# Altium schematic sheet Gesture_Sensor.SchDoc: GESTURE SENSOR
size 431 x 279 mm; Date: 02/07/2022; ApprovedBy: RTZ,HYW; CheckedBy: RTZ,HYW; Author: RTZ,HYW; CompanyName: Upenn; DrawnBy: RTZ,HYW; Engineer: RTZ,HYW; Organization: Upenn ESE; Address1: Electrical Engineering; Address2: 200 South 33rd St; Address3: Philadelphia; Address4: PA, 19104; SheetNumber: 10; SheetTotal: 11; ENG_APP_DATE: 02/15/22; DSN_APP_DATE: 02/15/22; CHK_APP_DATE: 02/15/22; DOC_NO_ASSY_DWG: TBD; DOC_NO_FAB_DWG: TBD; PCB_DWG_NO: TBD; Project: SimonSayGame; DESIGN_ITEM: 1.0; DOC_NO_SCH_DWG: TBD; SCH_SCALE: NA; CAGE_CODE: TBD; Time: 13:18
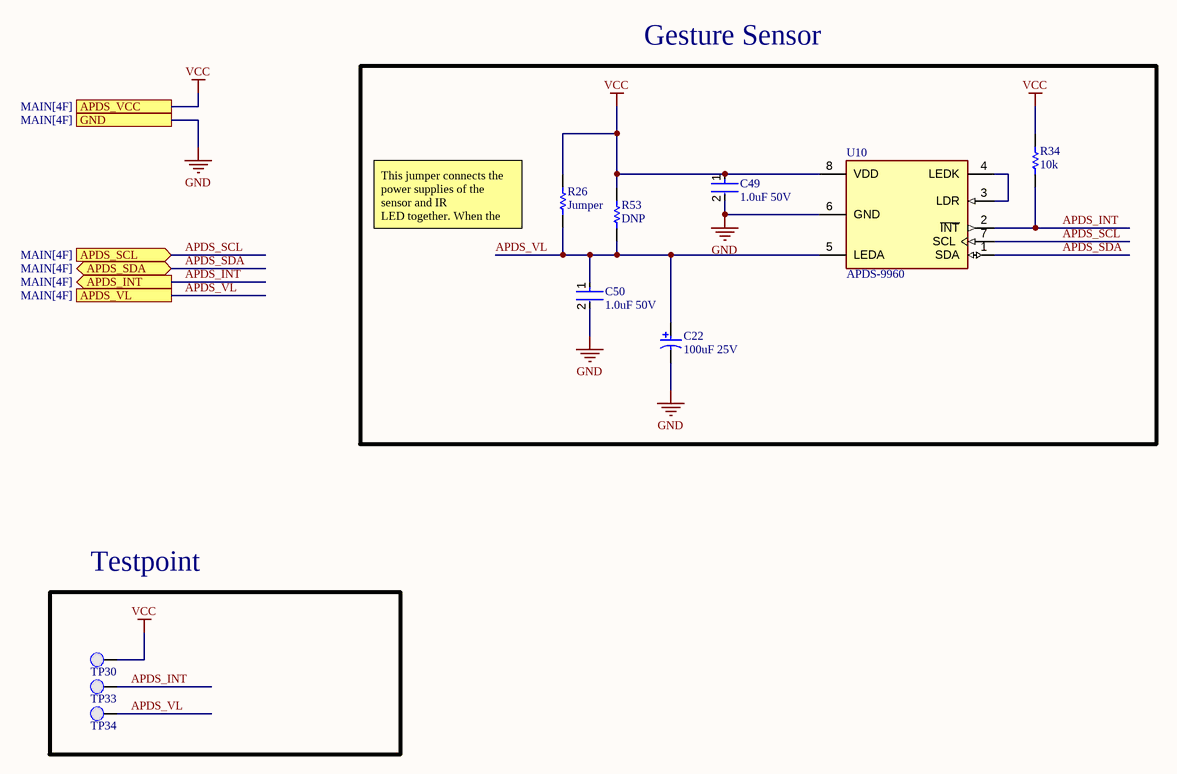
[diagram p0: Gesture_Sensor.SchDoc]

## Parts
C22  100uF 25V  [EDK107M025A9HAA]
C49  1.0uF 50V  [FP-0603-L_1_6_0_1-W_0_8_0-IPC_A]
C50  1.0uF 50V  [FP-0603-L_1_6_0_1-W_0_8_0-IPC_A]
R26  Jumper  [RESC0603(1608)_N]
R34  10k  [RESC1005X40X25ML05T05]
R53  DNP  [DNP]  (no BOM)
TP30  0.1" Pad  [PCBComponent]  (value not drawn)  (no BOM)
TP33  0.1" Pad  [PCBComponent]  (value not drawn)  (no BOM)
TP34  0.1" Pad  [PCBComponent]  (value not drawn)  (no BOM)
U10  APDS-9960  [FP-APDS-9960-MFG]

## Blocks framed on the sheet
Gesture Sensor: C22 C49 C50 R26 R34 R53 U10
Testpoint: TP30 TP33 TP34

## Ports
APDS_INT (out, see MAIN[4F]), APDS_SCL (in, see MAIN[4F]), APDS_SDA (bidir, see MAIN[4F]), APDS_VCC (see MAIN[4F]), APDS_VL (see MAIN[4F]), GND (see MAIN[4F])

## Nets
GND: C22.2 C49.2 C50.2 U10.6(GND) ; port GND
VCC: C49.1 R26.2 R34.2 R53.2 TP30.1(PAD) U10.8(VDD) ; port APDS_VCC
APDS_INT: R34.1 TP33.1(PAD) U10.2(~{INT}) ; port APDS_INT
APDS_SCL: U10.7(SCL) ; port APDS_SCL
APDS_SDA: U10.1(SDA) ; port APDS_SDA
APDS_VL: C22.1 C50.1 R26.1 R53.1 TP34.1(PAD) U10.5(LEDA) ; port APDS_VL
NetU10_3: U10.3(LDR) U10.4(LEDK)

## Notes on the sheet
- (near R26) This jumper connects the power supplies of the sensor and IR
  LED together. When the jumper is
  closed, VCC
  pin will power both the sensor and the IR LED. If the jumper is open,
  you need to provide power to both the VCC (2.4 - 3.6V) and VL (3.0 -
  4.5V) pins separately. This jumper is closed by default.
- DWG. NO.
- REV.
- SHT.
- THIS DOCUMENT AND THE DATA DISCLOSED HEREIN OR HEREWITH IS THE PROPERTY OF ALTIUM LIMITED AND MAY BE FREELY DISTRIBUTED IN WHOLE. NO RIGHTS ARE RESERVED OR EXPRESS OR IMPLIED WARANTEE GIVEN.
- REVISION
- DESCRIPTION
- DATE
- APPROVED
- ENG:
- APPROVALS
- PROJECT
- DSN:
- CHK:
- REFERENCE DOCUMENTS
- PROJECT REVISION:
- TITLE
- DOCUMENT REVISION:
- DESIGN ITEM:
- BOM:
- FAB DWG:
- PCB DWG:
- ASSY DWG:
- SCALE:
- SIZE
- B
- CAGE CODE
- FILE NAME
- DWG NO.
- SHEET
- OF
- REV

## Library data of the parts
C22 = CMP-0687-00063-1: Aluminum Electrolytic Capacitor, UD Series, Low Impedance, 100 uF, 25 V, + / - 20%, -40 to 85 degC, Chip Type, 6.3 x 7.7 mm D x L; PartNumber: UUD1E101MCL1GS; Manufacturer: Nichicon; Rated Ripple Current (at 100kHz): 280 mA; Endurance Time: 2000 h; Packing: Dia382mm Reel; Tolerance Rated Capacitance: -20 to 20%; Impedance: 0.34 Ohm; PackageReference: CAPAE-D6.3H7.7; RoHS: TRUE; PackageDescription: 2-Pin Surface Mount Device, Diameter 6.3 mm, Height 7.7 mm, Pitch 5.4 mm; Mounting Technology: Surface Mount; Rated Voltage: 25 V; ComponentLink3Description: Package Specification; Diameter: 6.3 mm; DatasheetVersion: 08/2012; ComponentLink3URL: http://products.nichicon.co.jp/en/pdf/XJA043/e-ud.pdf; Length: 7.7 mm; ComponentLink2Description: Datasheet; ComponentLink2URL: http://products.nichicon.co.jp/en/pdf/XJA043/e-ud.pdf; Rated Capacitance: 100 uF; ComponentLink1Description: Manufacturer URL; ComponentLink1URL: http://www.nichicon.co.jp/
C49 C50 = CMP-2000-05447-3: None; Tolerance: 10%; Capacitance: 1uF; Dielectric: X5R; Height: 0.8mm; Depth: 0.8mm; Number of Pins: 2; Length: 1.6mm; Thickness: 0.035inch; Voltage Rating: 50V; Contact Plating: Nickel; Radiation Hardening: No; Package Quantity: 1; Case/Package: 0603; Halogen Free: Halogen Free; RoHS Compliant: Yes; Termination: SMD/SMT; Max Operating Temperature: 85°C; Min Operating Temperature: -55°C; Case Code (Metric): 1608; Construction: Flat; Voltage Rating (DC): 50V; Packaging: Tape and Reel; Series: M; Case Code (Imperial): 0603; Width: 0.031inch; Mount: Surface Mount
R26 = CMP-1012-00001-1: Jumper 0603 (1608 Metric); Case-Metric: 1608; Value: 0.00 Ohm; Power: None; Case-EIA: 0603; Technology: SMT; Tolerance: None
R34 = CMP-2000-07588-1: Chip Resistor, 10 KOhm, +/- 1%, 0.1 W, -55 to 155 degC, 0402 (1005 Metric), RoHS, Tape and Reel; Manufacturer: Panasonic; Power Rating: 100mW; Voltage Rating: 50V; Resistance: 10KOhm; Case\/Package: 0402; Temperature Coefficient: 100ppm\/degreesC; RoHSCompliant: True; Lead Free: LeadFree; Package Quantity: 1; Contact Plating: Tin; Length: 1mm; Radiation Hardening: No; REACH SVHC: NoSVHC; Max Operating Temperature: 155degC; Depth: 0.5mm; Case Code (Imperial): 0402; Military Standard: Not; Package Description: 2-Pin Surface Mount Device, Body 1 x 0.5 mm; Termination: SMD/SMT; Case Code (Metric): 1005; Height: 0.35mm; Packaging: TapeandReel; Voltage Rating (DC): 50V; Package Reference: 402; Number of Pins: 2; Tolerance: 1%; Mounting Technology: SurfaceMount; Width: 0.02inch; Mount: SurfaceMount; Datasheet URL: https://industrial.panasonic.com/cdbs/www-data/pdf/RDA0000/AOA0000C304.pdf; Composition: ThickFilm; Datasheet Version: 02/2017; Manufacturer URL: http://www.panasonic.com/; Max Power Dissipation: 100mW; Number of Terminations: 2; Min Operating Temperature: -55degC
R53 = DNP: Temperature Coefficient: 100ppm/°C; Power Rating: 63mW; Voltage Rating: 50V; Resistance Tolerance: 1%; RoHS: Yes; Case/Package: 0402; Number of Pins: 2; Contact Plating: Tin; Case Code (Metric): 1005; Case Code (Imperial): 0402; Min Operating Temperature: -55°C; Max Operating Temperature: 155°C; Resistor Type: Thick Film; Package Quantity: 10; Number of Terminations: 2; Termination: SMD/SMT; Max Power Dissipation: 63mW; Features: Automotive AEC-Q200; Series: CRCW; Voltage Rating (DC): 50V; Construction: Rectangular; Technology: THICK FILM; Length: 1mm; Width: 0.02inch; Height: 0.35mm; Depth: 0.5mm; Radiation Hardening: No; RoHS Compliant: Yes; Lead Free: Lead Free; REACH SVHC: Unknown; Military Standard: Not
TP30 TP33 TP34 = 0.1" Pad-A.4
U10 = CMP-2000-05060-2: SENSOR OPT 560NM AMBIENT MODULE; Max Supply Voltage (DC): 3.6V; Min Supply Voltage (DC): 2.4V; Sensing Distance: 100mm; Output Type: Digital; Min Operating Temperature: -30°C; Wavelength: 560nm; REACH SVHC: No SVHC; Packaging: Tape and Reel; Max Operating Temperature: 85°C; Mount: Surface Mount; Case/Package: SMD/SMT; Number of Pins: 8